# Altium schematic sheet RES_ASSEMBLY.SchDoc
size 420 x 297 mm; DocumentNumber: АЕСН.466369.100Э3; SheetNumber: 6
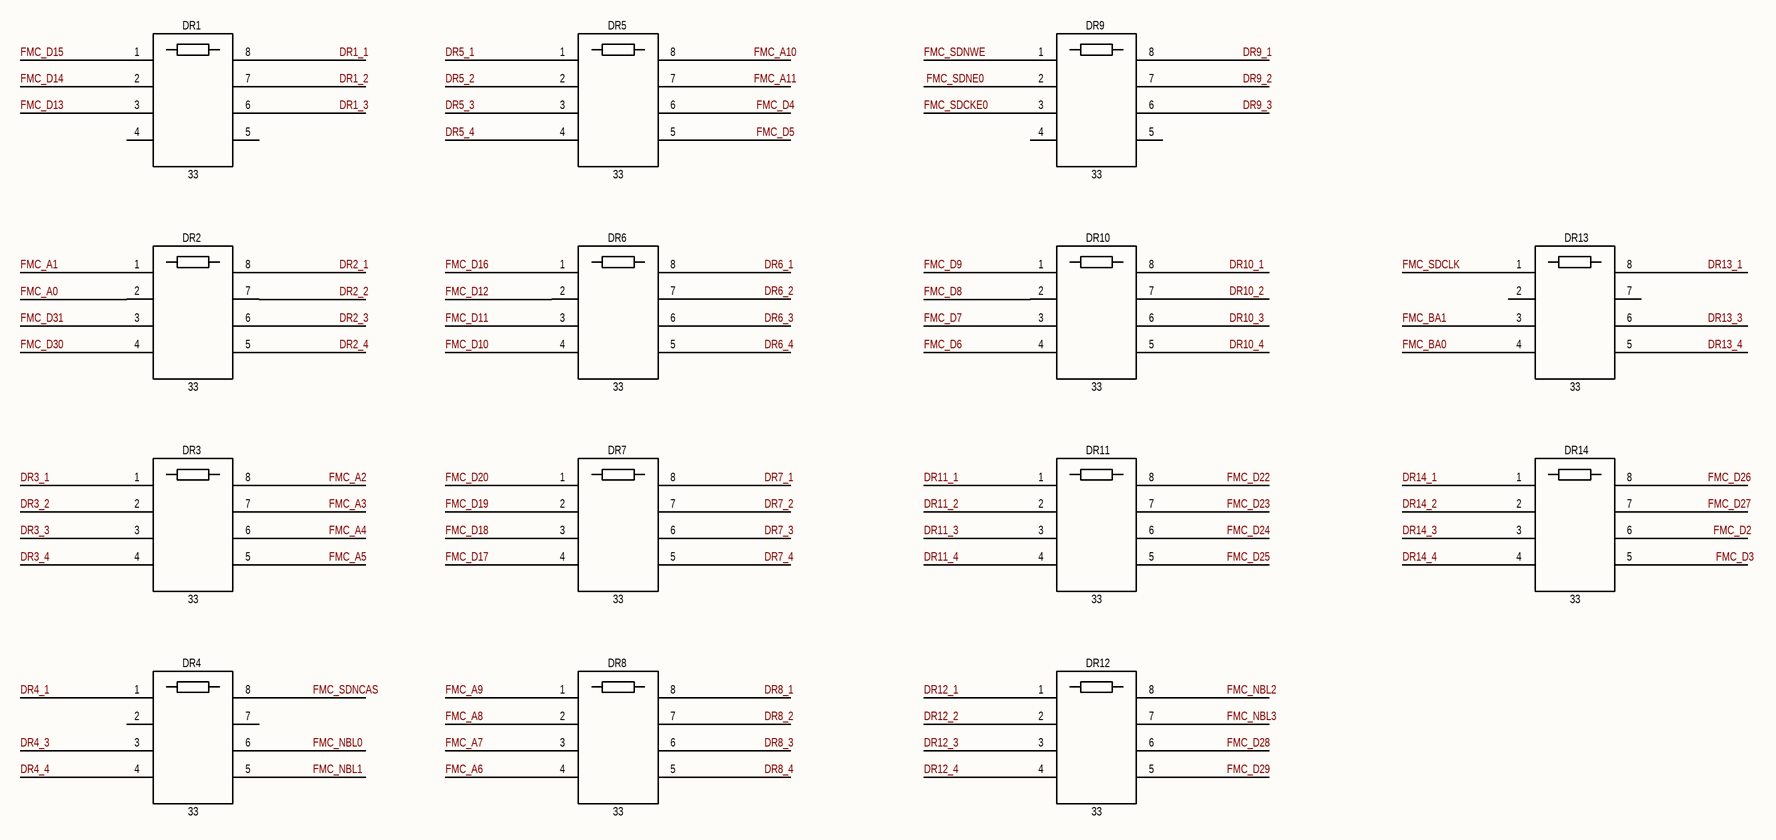
[diagram p0: RES_ASSEMBLY.SchDoc]

## Parts
DR1  33  [CAT16]
DR2  33  [CAT16]
DR3  33  [CAT16]
DR4  33  [CAT16]
DR5  33  [CAT16]
DR6  33  [CAT16]
DR7  33  [CAT16]
DR8  33  [CAT16]
DR9  33  [CAT16]
DR10  33  [CAT16]
DR11  33  [CAT16]
DR12  33  [CAT16]
DR13  33  [CAT16]
DR14  33  [CAT16]

## Nets
DR1_1: DR1.8
DR1_2: DR1.7
DR1_3: DR1.6
DR2_1: DR2.8
DR2_2: DR2.7
DR2_3: DR2.6
DR2_4: DR2.5
DR3_1: DR3.1
DR3_2: DR3.2
DR3_3: DR3.3
DR3_4: DR3.4
DR4_1: DR4.1
DR4_3: DR4.3
DR4_4: DR4.4
DR5_1: DR5.1
DR5_2: DR5.2
DR5_3: DR5.3
DR5_4: DR5.4
DR6_1: DR6.8
DR6_2: DR6.7
DR6_3: DR6.6
DR6_4: DR6.5
DR7_1: DR7.8
DR7_2: DR7.7
DR7_3: DR7.6
DR7_4: DR7.5
DR8_1: DR8.8
DR8_2: DR8.7
DR8_3: DR8.6
DR8_4: DR8.5
DR9_1: DR9.8
DR9_2: DR9.7
DR9_3: DR9.6
DR10_1: DR10.8
DR10_2: DR10.7
DR10_3: DR10.6
DR10_4: DR10.5
DR11_1: DR11.1
DR11_2: DR11.2
DR11_3: DR11.3
DR11_4: DR11.4
DR12_1: DR12.1
DR12_2: DR12.2
DR12_3: DR12.3
DR12_4: DR12.4
DR13_1: DR13.8
DR13_3: DR13.6
DR13_4: DR13.5
DR14_1: DR14.1
DR14_2: DR14.2
DR14_3: DR14.3
DR14_4: DR14.4
FMC_A0: DR2.2
FMC_A1: DR2.1
FMC_A2: DR3.8
FMC_A3: DR3.7
FMC_A4: DR3.6
FMC_A5: DR3.5
FMC_A6: DR8.4
FMC_A7: DR8.3
FMC_A8: DR8.2
FMC_A9: DR8.1
FMC_A10: DR5.8
FMC_A11: DR5.7
FMC_BA0: DR13.4
FMC_BA1: DR13.3
FMC_D2: DR14.6
FMC_D3: DR14.5
FMC_D4: DR5.6
FMC_D5: DR5.5
FMC_D6: DR10.4
FMC_D7: DR10.3
FMC_D8: DR10.2
FMC_D9: DR10.1
FMC_D10: DR6.4
FMC_D11: DR6.3
FMC_D12: DR6.2
FMC_D13: DR1.3
FMC_D14: DR1.2
FMC_D15: DR1.1
FMC_D16: DR6.1
FMC_D17: DR7.4
FMC_D18: DR7.3
FMC_D19: DR7.2
FMC_D20: DR7.1
FMC_D22: DR11.8
FMC_D23: DR11.7
FMC_D24: DR11.6
FMC_D25: DR11.5
FMC_D26: DR14.8
FMC_D27: DR14.7
FMC_D28: DR12.6
FMC_D29: DR12.5
FMC_D30: DR2.4
FMC_D31: DR2.3
FMC_NBL0: DR4.6
FMC_NBL1: DR4.5
FMC_NBL2: DR12.8
FMC_NBL3: DR12.7
FMC_SDCKE0: DR9.3
FMC_SDCLK: DR13.1
FMC_SDNCAS: DR4.8
FMC_SDNE0: DR9.2
FMC_SDNWE: DR9.1

Not connected (* = marked no-connect by the designer): DR1 4 5; DR4 2 7; DR9 4 5; DR13 2 7

## Notes on the sheet
- Подп. и дата
- Инв.№ дубл.
- Взам. инв. №
- Инв № подл.
- Изм.
- Лист
- № докум.
- Подп.
- Дата
- Копировал
- Формат А3

## Library data of the parts
DR1-DR14 = CAT16